# Altium project project6.PrjPcb
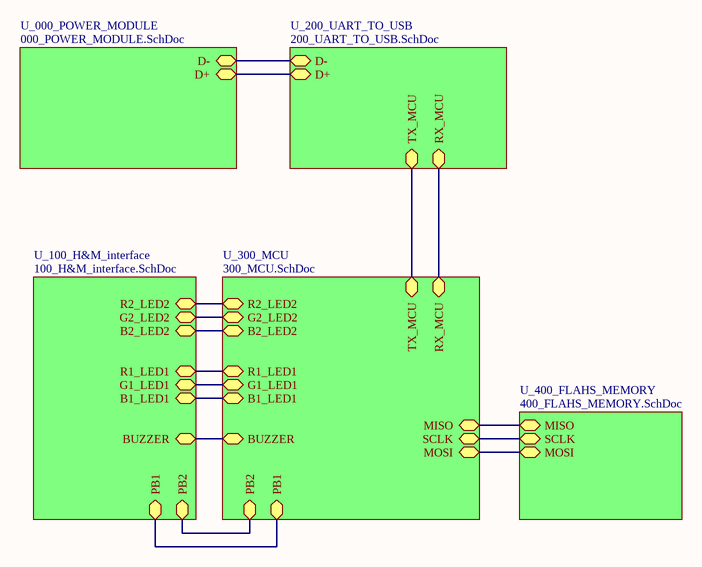
[diagram p0: MAIN.SchDoc]
6 sheets, 86 parts. Net scope: hierarchical (ports join the sheet entries above them; power ports are global).
Board file: project_6.PcbDoc
Sheets:
  MAIN.SchDoc
    U_000_POWER_MODULE = 000_POWER_MODULE.SchDoc
    U_200_UART_TO_USB = 200_UART_TO_USB.SchDoc
    U_100_H&M_interface = 100_H&M_interface.SchDoc
    U_400_FLAHS_MEMORY = 400_FLAHS_MEMORY.SchDoc
    U_300_MCU = 300_MCU.SchDoc

## Sheet MAIN.SchDoc: MAIN
size A4; Organization: Altium Limited; Address1: L3, 12a Rodborough Rd; Address2: Frenchs Forest; Address3: NSW; Address4: Australia 2086; DocumentNumber: 1; SheetNumber: 1; SheetTotal: 6

### Sub-sheets
U_000_POWER_MODULE = 000_POWER_MODULE.SchDoc: D- (bidir), D+ (bidir)
U_100_H&M_interface = 100_H&M_interface.SchDoc: PB1 (bidir), PB2 (bidir), B2_LED2 (bidir), G2_LED2 (bidir), R2_LED2 (bidir), G1_LED1 (bidir), B1_LED1 (bidir), R1_LED1 (bidir), BUZZER (bidir)
U_200_UART_TO_USB = 200_UART_TO_USB.SchDoc: D- (bidir), D+ (bidir), TX_MCU (bidir), RX_MCU (bidir)
U_300_MCU = 300_MCU.SchDoc: SCLK (bidir), MISO (bidir), MOSI (bidir), PB1 (bidir), B2_LED2 (bidir), TX_MCU (bidir), RX_MCU (bidir), R1_LED1 (bidir), G2_LED2 (bidir), R2_LED2 (bidir), G1_LED1 (bidir), B1_LED1 (bidir), PB2 (bidir), BUZZER (bidir)
U_400_FLAHS_MEMORY = 400_FLAHS_MEMORY.SchDoc: MISO (bidir), SCLK (bidir), MOSI (bidir)

### Nets
NetC100_2: sheet U_100_H&M_interface/PB2, sheet U_300_MCU/PB2
NetC101_2: sheet U_100_H&M_interface/PB1, sheet U_300_MCU/PB1
NetR104_1: sheet U_100_H&M_interface/R1_LED1, sheet U_300_MCU/R1_LED1
NetR105_1: sheet U_100_H&M_interface/R2_LED2, sheet U_300_MCU/R2_LED2
NetR108_1: sheet U_100_H&M_interface/BUZZER, sheet U_300_MCU/BUZZER
NetR111_1: sheet U_100_H&M_interface/G1_LED1, sheet U_300_MCU/G1_LED1
NetR112_1: sheet U_100_H&M_interface/G2_LED2, sheet U_300_MCU/G2_LED2
NetR120_1: sheet U_100_H&M_interface/B1_LED1, sheet U_300_MCU/B1_LED1
NetR121_1: sheet U_100_H&M_interface/B2_LED2, sheet U_300_MCU/B2_LED2
NetR300_15: sheet U_400_FLAHS_MEMORY/SCLK, sheet U_300_MCU/SCLK
NetR300_16: sheet U_400_FLAHS_MEMORY/MISO, sheet U_300_MCU/MISO
NetR300_17: sheet U_400_FLAHS_MEMORY/MOSI, sheet U_300_MCU/MOSI
NetR300_30: sheet U_200_UART_TO_USB/TX_MCU, sheet U_300_MCU/TX_MCU
NetR300_31: sheet U_200_UART_TO_USB/RX_MCU, sheet U_300_MCU/RX_MCU
NetU2_4: sheet U_000_POWER_MODULE/D+, sheet U_200_UART_TO_USB/D+
NetU2_6: sheet U_000_POWER_MODULE/D-, sheet U_200_UART_TO_USB/D-

### Notes on the sheet
- Title
- Size:
- Date:
- A4
- Number:
- Time:
- Revision:
- Sheet
- of
- File:

## Sheet 000_POWER_MODULE.SchDoc: Power and inputs
size A4; Organization: Altium Limited; Address1: L3, 12a Rodborough Rd; Address2: Frenchs Forest; Address3: NSW; Address4: Australia 2086; DocumentNumber: 2; SheetNumber: 2; SheetTotal: 6
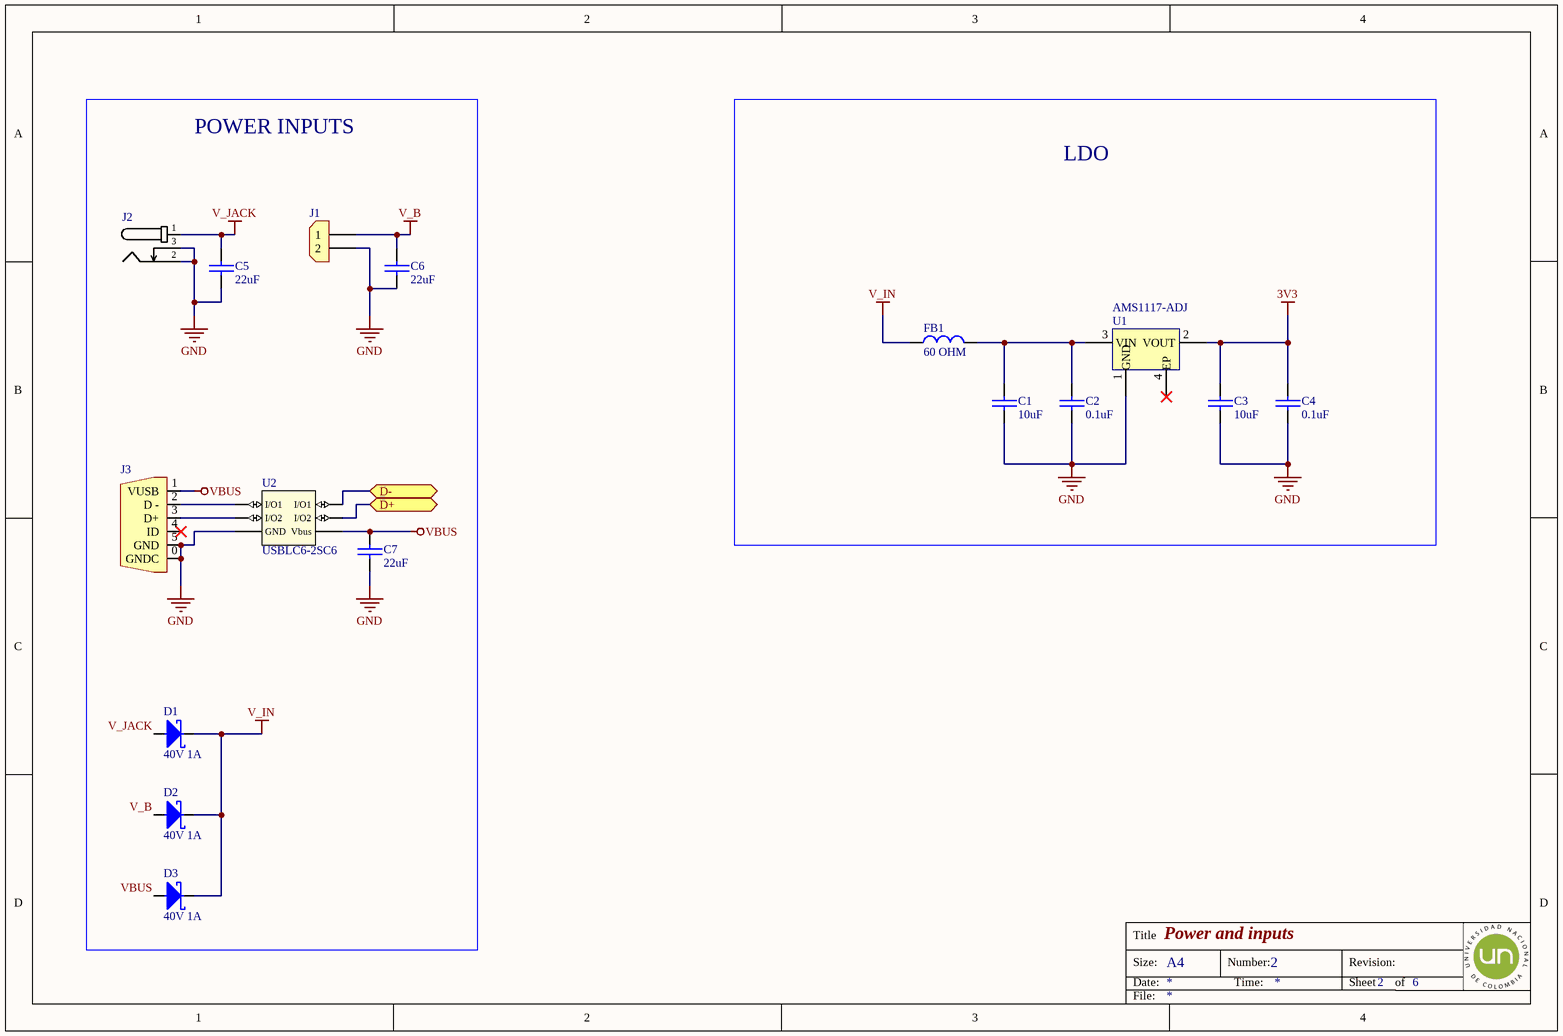
[diagram p1: 000_POWER_MODULE.SchDoc]

### Parts
C1  value 10uF  [0603_cap]  (hidden comment: 10uF 10V)
C2  value 0.1uF  [0603_cap]  (hidden comment: 0.1uF 50V)
C3  value 10uF  [0603_cap]  (hidden comment: 10uF 10V)
C4  value 0.1uF  [0603_cap]  (hidden comment: 0.1uF 50V)
C5  value 22uF  [0603_cap]  (hidden comment: 22uF 6V3)
C6  value 22uF  [0603_cap]  (hidden comment: 22uF 6V3)
C7  value 22uF  [0603_cap]  (hidden comment: 22uF 6V3)
D1  40V 1A  [SOD_123]
D2  40V 1A  [SOD_123]
D3  40V 1A  [SOD_123]
FB1  value 60 OHM  [0603_fb]  (hidden comment: 60OHM 2A)
J1  Connector 2pos  [CON_2x1_TH_5MM]  (value not drawn)
J2  PWR JACK 2.1mm  [CON_POWER_BARREL_2.1MM_3CONN]  (value not drawn)
J3  USB Mini B  [CON_5x1_SMD_miniUSB_B]  (value not drawn)
U1  AMS1117-ADJ  [SOT_223]
U2  USBLC6-2SC6  [SOT_23_6]

### Blocks framed on the sheet
POWER INPUTS: C5-C7 D1-D3 J1-J3 U2
LDO: C1-C4 FB1 U1

### Ports
D+ (bidir, see MAIN[2B], 200_UART_TO_USB[2B]), D- (bidir, see MAIN[2B], 200_UART_TO_USB[2B])

### Nets
3V3: C3.1 C4.1 U1.2(VOUT)
GND: C1.2 C2.2 C3.2 C4.2 C5.2 C6.2 C7.2 J1.2 J2.2 J2.3 J3.0(GNDC) J3.5(GND) U1.1(GND) U2.2(GND)
V_B: C6.1 D2.2 J1.1
V_IN: D1.1 D2.1 D3.1 FB1.1
V_JACK: C5.1 D1.2 J2.1
VBUS: C7.1 D3.2 J3.1(VUSB) U2.5(Vbus)
NetC1_1: C1.1 C2.1 FB1.2 U1.3(VIN)
NetJ3_2: J3.2(D_-) U2.1(I/O1)
NetJ3_3: J3.3(D+) U2.3(I/O2)
NetU2_4: U2.4(I/O2) ; port D+
NetU2_6: U2.6(I/O1) ; port D-

Not connected (* = marked no-connect by the designer): J3 4(ID)*; U1 4(EP)*

### Notes on the sheet
- Title
- Size:
- Date:
- A4
- Number:
- Time:
- Revision:
- Sheet
- of
- File:

### Library data of the parts
C1 C3 = Cap_10uF_0603_10V: 10V 10uF X5R ±10% 0603 Multilayer Ceramic Capacitors MLCC - SMD/SMT ROHS; Manufacturer: CCTC; Manufacturer Part Number: TCC0603X5R106K100CT; Supplier 1: LCSC; Supplier Part Number 1: C380314; ComponentLink1Description: LCSC; ComponentLink1URL: https://www.lcsc.com/product-detail/Multilayer-Ceramic-Capacitors-MLCC-SMD-SMT_CCTC-TCC0603X5R106K100CT_C380314.html
C2 C4 = Cap_0.1uF_0603_50V: 50V 100nF Y5V -20%~+80% 0603 Multilayer Ceramic Capacitors MLCC - SMD/SMT ROHS; Manufacturer: Walsin Tech Corp; Manufacturer Part Number: 0603F104Z500CT; Supplier 1: LCSC; Supplier Part Number 1: C83060; ComponentLink1Description: LCSC; ComponentLink1URL: https://www.lcsc.com/product-detail/Multilayer-Ceramic-Capacitors-MLCC-SMD-SMT_Walsin-Tech-Corp-0603F104Z500CT_C83060.html
C5-C7 = Cap_22uF_0805_6V3: 6.3V 22uF X5R ±20% 0805 Multilayer Ceramic Capacitors MLCC - SMD/SMT ROHS; Manufacturer: Samsung Electro-Mechanics; Manufacturer Part Number: CL21A226MQQNNNE; Supplier 1: LCSC; Supplier Part Number 1: C5674; ComponentLink1Description: LCSC; ComponentLink1URL: https://www.lcsc.com/product-detail/Multilayer-Ceramic-Capacitors-MLCC-SMD-SMT_Samsung-Electro-Mechanics-CL21A226MQQNNNE_C5674.html
D1-D3 = D_Schottky_40V_1A_SOD_123F: DIODE SCHOTTKY 40V 1A SOD123F; Manufacturer: Shanghai Prisemi Elec; Manufacturer Part Number: PSBD1DF40V1H; Supplier 1: LCSC; Supplier Part Number 1: C110730; ComponentLink1Description: LCSC; ComponentLink1URL: https://www.lcsc.com/product-detail/Switching-Diode_Shanghai-Prisemi-Elec-PSBD1DF40V1H_C110730.html
FB1 = FB_60_0603_2A: 2A 1 100mΩ 60Ω@100MHz ±25% 0603 Ferrite Beads ROHS; Manufacturer: TAI-TECH; Manufacturer Part Number: HCB1608KF-600T20; ComponentLink1Description: LCSC; ComponentLink1URL: https://www.lcsc.com/product-detail/Ferrite-Beads_TAI-TECH-HCB1608KF-600T20_C369516.html; Supplier 1: LCSC; Supplier Part Number 1: C369516
J1 = Con_2x1_TH_5mm: 2POS 5MM; Manufacturer: JILN; Manufacturer Part Number: JL126-50002G01; Supplier 1: LCSC; Supplier Part Number 1: C394556; ComponentLink1Description: Digi-Key; ComponentLink1URL: https://www.lcsc.com/product-detail/Screw-terminal_JILN-JL126-50002G01_C394556.html
J2 = Con_Power_Jack_2.1mm_3pins: CONN PWR JACK 2X5.5MM SOLDER; Manufacturer: HCTL; Manufacturer Part Number: HC-DC-005-2.0T; Supplier 1: LCSC; Supplier Part Number 1: C3010533; ComponentLink1Description: LCSC; ComponentLink1URL: https://www.lcsc.com/product-detail/AC-DC-Power-Connectors_HCTL-HC-DC-005-2-0T_C3010533.html
J3 = Con_Mini_USB_B: CONN RCPT USB2.0 MINI B SMD R/A; Manufacturer Part Number: KH-MINI-SMT-5P-Cu; Manufacturer: EDAC Inc.; ComponentLink1Description: LCSC; ComponentLink1URL: https://datasheet.lcsc.com/lcsc/2106070035_Shenzhen-Kinghelm-Elec-KH-MINI-SMT-5P-Cu_C2688795.pdf; Supplier 1: LCSC; Supplier Part Number 1: C2688795
U1 = LDO_3V3_1A: 1A 70dB@(120Hz) 5mA 1.2V@1A Adjustable 1.2V~20V Positive 1 20V Output Adjustable SOT-223-3L Linear Voltage Regulators (LDO) ROHS; Manufacturer: WPMtek(Wei Pan Microelectronics); ComponentLink1Description: LCSC; ComponentLink1URL: https://www.lcsc.com/product-detail/Linear-Voltage-Regulators-LDO_WPMtek-Wei-Pan-Microelectronics-AMS1117-ADJ_C2688238.html; Supplier: LCSC; Manufacturer Part Number: AMS1117-ADJ; Supplier Part Number: C2688238
U2 = TVS_5.25V_2CH_SOT_23_6: TVS DIODE 5.25V 17V SOT23-6; Manufacturer: STMicroelectronics; ComponentLink1Description: LCSC; ComponentLink1URL: https://www.lcsc.com/product-detail/ESD-Protection-Devices_STMicroelectronics-USBLC6-2SC6_C7519.html; Supplier 1: LCSC; Manufacturer Part Number: USBLC6-2SC6; Supplier Part Number 1: C7519

## Sheet 200_UART_TO_USB.SchDoc: USART to USB
size A4; Organization: Altium Limited; Address1: L3, 12a Rodborough Rd; Address2: Frenchs Forest; Address3: NSW; Address4: Australia 2086; DocumentNumber: 4; SheetNumber: 4; SheetTotal: 6
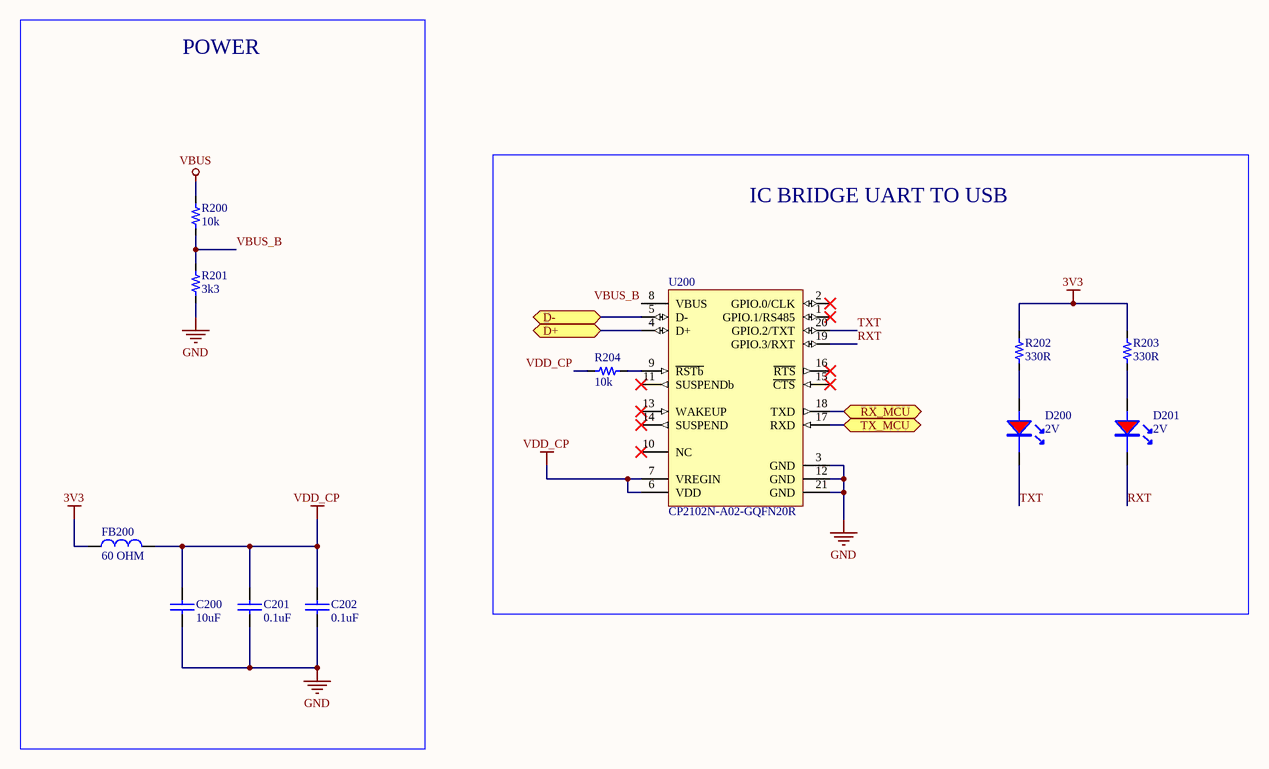
[diagram p2: 200_UART_TO_USB.SchDoc]

### Parts
C200  value 10uF  [0603_cap]  (hidden comment: 10uF 10V)
C201  value 0.1uF  [0603_cap]  (hidden comment: 0.1uF 50V)
C202  value 0.1uF  [0603_cap]  (hidden comment: 0.1uF 50V)
D200  2V  [0805_LED]
D201  2V  [0805_LED]
FB200  value 60 OHM  [0603_fb]  (hidden comment: 60OHM 2A)
R200  value 10k  [0603_res]  (hidden comment: 10k 1/10W)
R201  value 3k3  [0603_res]  (hidden comment: 3k3 1/10W)
R202  value 330R  [0603_res]  (hidden comment: 330R 1/10W)
R203  value 330R  [0603_res]  (hidden comment: 330R 1/10W)
R204  value 10k  [0603_res]  (hidden comment: 10k 1/10W)
U200  CP2102N-A02-GQFN20R  [WFQFN_20_EP_3X3MM]

### Blocks framed on the sheet
POWER: C200-C202 FB200 R200 R201
IC BRIDGE UART TO USB: D200 D201 R202-R204 U200

### Ports
D+ (bidir, see MAIN[3A], 000_POWER_MODULE[1B]), D- (bidir, see MAIN[3A], 000_POWER_MODULE[1B]), RX_MCU (bidir, see MAIN[3B], 300_MCU[3B]), TX_MCU (bidir, see MAIN[3B], 300_MCU[3A])

### Nets
3V3: FB200.1 R202.2 R203.2
GND: C200.2 C201.2 C202.2 R201.1 U200.3(GND) U200.12(GND) U200.21(GND)
VBUS: R200.2
VDD_CP: C200.1 C201.1 C202.1 FB200.2 R204.1 U200.6(VDD) U200.7(VREGIN)
RXT: D201.2 U200.19(GPIO.3/RXT)
TXT: D200.2 U200.20(GPIO.2/TXT)
VBUS_B: R200.1 R201.2 U200.8(VBUS)
NetD200_1: D200.1(A) R202.1
NetD201_1: D201.1(A) R203.1
NetR204_2: R204.2 U200.9(~{RSTb})
NetR300_30: U200.17(RXD) ; port TX_MCU
NetR300_31: U200.18(TXD) ; port RX_MCU
NetU2_4: U200.4(D+) ; port D+
NetU2_6: U200.5(D-) ; port D-

Not connected (* = marked no-connect by the designer): U200 1(GPIO.1/RS485)* 2(GPIO.0/CLK)* 10(NC)* 11(SUSPENDb)* 13(WAKEUP)* 14(SUSPEND)* 15(~{CTS})* 16(~{RTS})*

### Notes on the sheet
- Title
- Size:
- Date:
- A4
- Number:
- Time:
- Revision:
- Sheet
- of
- File:

### Library data of the parts
C200 = Cap_10uF_0603_10V: as C1 on sheet 000_POWER_MODULE; Supplier 1: LCSC; Supplier Part Number 1: C380314; ComponentLink1Description: LCSC; ComponentLink1URL: https://www.lcsc.com/product-detail/Multilayer-Ceramic-Capacitors-MLCC-SMD-SMT_CCTC-TCC0603X5R106K100CT_C380314.html
C201 C202 = Cap_0.1uF_0603_50V: as C2 on sheet 000_POWER_MODULE; Supplier 1: LCSC; Supplier Part Number 1: C83060; ComponentLink1Description: LCSC; ComponentLink1URL: https://www.lcsc.com/product-detail/Multilayer-Ceramic-Capacitors-MLCC-SMD-SMT_Walsin-Tech-Corp-0603F104Z500CT_C83060.html
D200 D201 = LED_0805_RED: LED RED CLEAR 0805 SMD; Manufacturer: XINGLIGHT; Manufacturer Part Number: XL-2012SURC; Supplier 1: LCSC; Supplier Part Number 1: C965812; ComponentLink1Description: LCSC; ComponentLink1URL: https://www.lcsc.com/product-detail/Light-Emitting-Diodes-LED_XINGLIGHT-XL-2012SURC_C965812.html
FB200 = FB_60_0603_2A: as FB1 on sheet 000_POWER_MODULE; ComponentLink1Description: LCSC; ComponentLink1URL: https://www.lcsc.com/product-detail/Ferrite-Beads_TAI-TECH-HCB1608KF-600T20_C369516.html; Supplier 1: LCSC; Supplier Part Number 1: C369516
R200 R204 = Res_10k_0603_1/10W: RES SMD 10k OHM 5% 1/10W 0603; Manufacturer: FOJAN; Manufacturer Part Number: FRC0603J103TS; ComponentLink1URL: https://www.lcsc.com/product-detail/Chip-Resistor-Surface-Mount_FOJAN-FRC0603J103TS_C2930027.html; Supplier 1: LCSC; Supplier Part Number 1: C2930027; ComponentLink1Description: LCSC
R201 = Res_3k3_0603_1/10W: RES SMD 3k3 OHM 5% 1/10W 0603; Manufacturer: FOJAN; Manufacturer Part Number: FRC0603J332 TS; ComponentLink1URL: https://www.lcsc.com/product-detail/Chip-Resistor-Surface-Mount_FOJAN-FRC0603J332-TS_C2907140.html; Supplier 1: LCSC; Supplier Part Number 1: C2907140; ComponentLink1Description: LCSC
R202 R203 = Res_330R_0603_1/10W: RES SMD 330R OHM 5% 1/10W 0603; Manufacturer: FOJAN; Manufacturer Part Number: FRC0603J331 TS; ComponentLink1URL: https://www.lcsc.com/product-detail/Chip-Resistor-Surface-Mount_FOJAN-FRC0603J331-TS_C2907152.html; Supplier 1: LCSC; Supplier Part Number 1: C2907152; ComponentLink1Description: LCSC
U200 = IC_SGL_USB2UART-BRIDGE_20QFN: IC USB TO UART BRIDGE QFN20; Manufacturer: Silicon Labs; Manufacturer Part Number: CP2102N-A02-GQFN20R; Supplier 1: LCSC; Supplier Part Number 1: C969913; ComponentLink1Description: LCSC; ComponentLink1URL: https://www.lcsc.com/product-detail/USB-ICs_SILICON-LABS-CP2102N-A02-GQFN20R_C969913.html

## Sheet 100_H&M_interface.SchDoc: H&M interface
size A4; Organization: Altium Limited; Address1: L3, 12a Rodborough Rd; Address2: Frenchs Forest; Address3: NSW; Address4: Australia 2086; DocumentNumber: 3; SheetNumber: 3; SheetTotal: 6
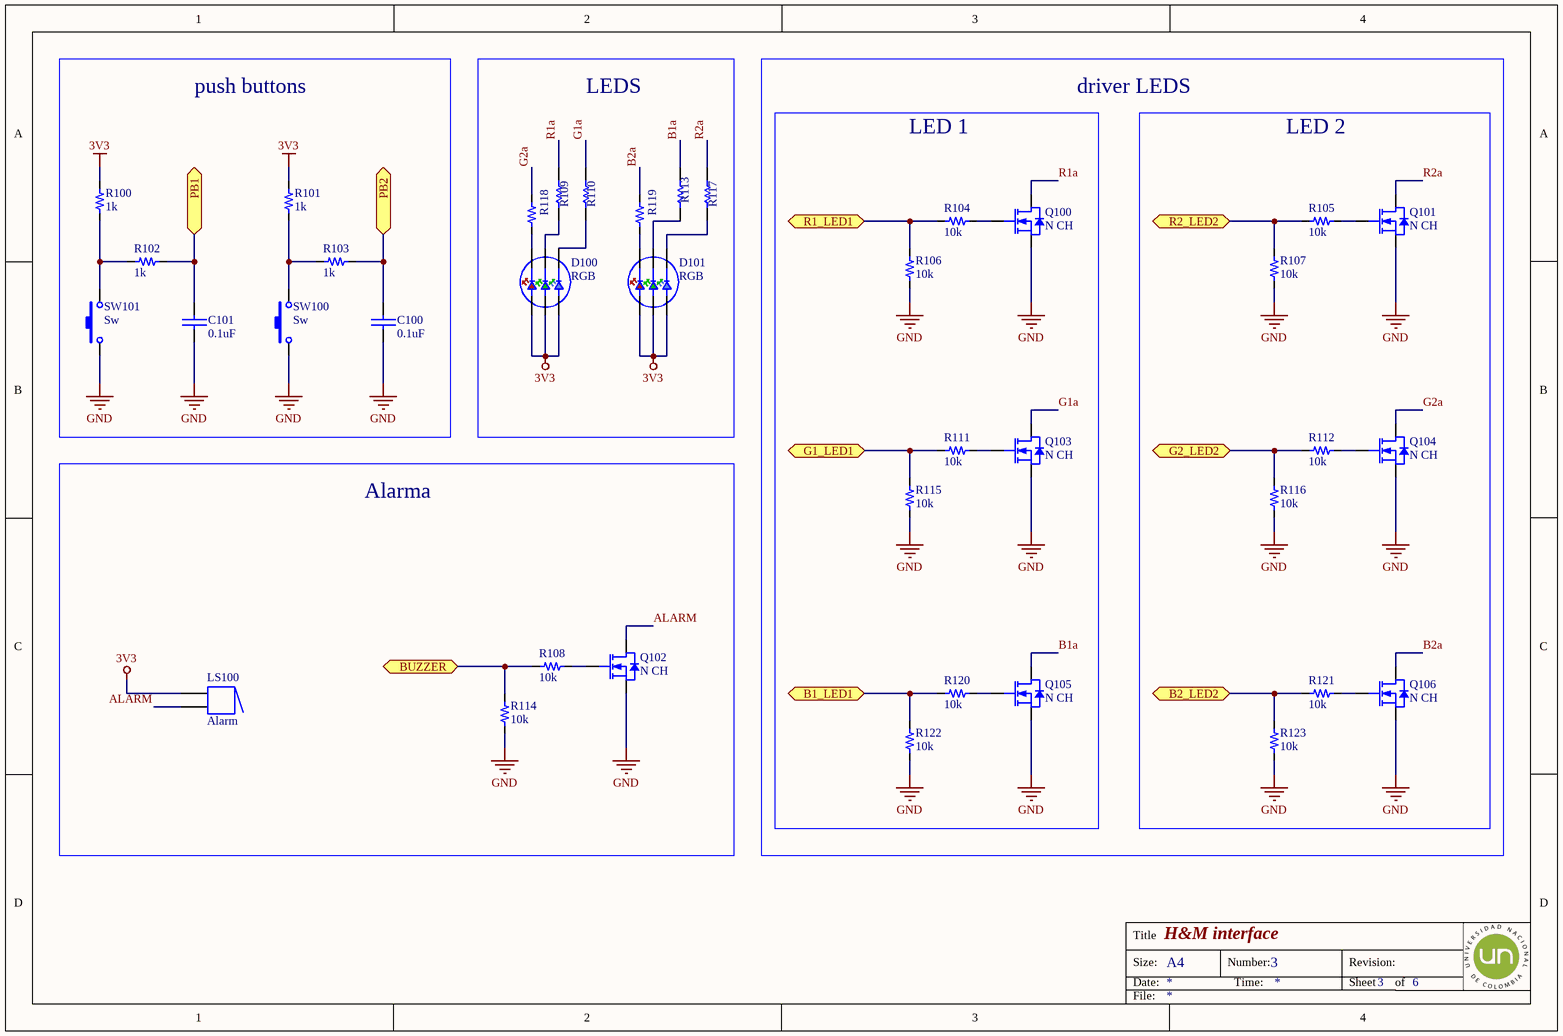
[diagram p3: 100_H&M_interface.SchDoc]

### Parts
C100  value 0.1uF  [0603_cap]  (hidden comment: 0.1uF 50V)
C101  value 0.1uF  [0603_cap]  (hidden comment: 0.1uF 50V)
D100  RGB  [RGB_NS_3.5X3.7]
D101  RGB  [RGB_NS_3.5X3.7]
LS100  Alarm  [Alarm]
Q100  N CH  [SOT_23_3]
Q101  N CH  [SOT_23_3]
Q102  N CH  [SOT_23_3]
Q103  N CH  [SOT_23_3]
Q104  N CH  [SOT_23_3]
Q105  N CH  [SOT_23_3]
Q106  N CH  [SOT_23_3]
R100  value 1k  [0603_res]  (hidden comment: 1k 1/10W)
R101  value 1k  [0603_res]  (hidden comment: 1k 1/10W)
R102  value 1k  [0603_res]  (hidden comment: 1k 1/10W)
R103  value 1k  [0603_res]  (hidden comment: 1k 1/10W)
R104  value 10k  [0603_res]  (hidden comment: 10k 1/10W)
R105  value 10k  [0603_res]  (hidden comment: 10k 1/10W)
R106  value 10k  [0603_res]  (hidden comment: 10k 1/10W)
R107  value 10k  [0603_res]  (hidden comment: 10k 1/10W)
R108  value 10k  [0603_res]  (hidden comment: 10k 1/10W)
R109  330R 1/10W  [0603_res]  (value not drawn)
R110  330R 1/10W  [0603_res]  (value not drawn)
R111  value 10k  [0603_res]  (hidden comment: 10k 1/10W)
R112  value 10k  [0603_res]  (hidden comment: 10k 1/10W)
R113  330R 1/10W  [0603_res]  (value not drawn)
R114  value 10k  [0603_res]  (hidden comment: 10k 1/10W)
R115  value 10k  [0603_res]  (hidden comment: 10k 1/10W)
R116  value 10k  [0603_res]  (hidden comment: 10k 1/10W)
R117  330R 1/10W  [0603_res]  (value not drawn)
R118  330R 1/10W  [0603_res]  (value not drawn)
R119  330R 1/10W  [0603_res]  (value not drawn)
R120  value 10k  [0603_res]  (hidden comment: 10k 1/10W)
R121  value 10k  [0603_res]  (hidden comment: 10k 1/10W)
R122  value 10k  [0603_res]  (hidden comment: 10k 1/10W)
R123  value 10k  [0603_res]  (hidden comment: 10k 1/10W)
SW100  Sw  [Sw_PUSH_4.5x4.5x5mm]
SW101  Sw  [Sw_PUSH_4.5x4.5x5mm]

### Blocks framed on the sheet
push buttons: C100 C101 R100-R103 SW100 SW101
LEDS: D100 D101 R109 R110 R113 R117-R119
LED 2: Q101 Q104 Q106 R105 R107 R112 R116 R121 R123
Alarma: LS100 Q102 R108 R114

### Ports
B1_LED1 (bidir, see MAIN[2C], 300_MCU[3B]), B2_LED2 (bidir, see MAIN[2C], 300_MCU[3B]), BUZZER (bidir, see MAIN[2C], 300_MCU[3A]), G1_LED1 (bidir, see MAIN[2C], 300_MCU[3B]), G2_LED2 (bidir, see MAIN[2C], 300_MCU[3B]), PB1 (bidir, see MAIN[2C], 300_MCU[3B]), PB2 (bidir, see MAIN[2C], 300_MCU[3B]), R1_LED1 (bidir, see MAIN[2C], 300_MCU[3B]), R2_LED2 (bidir, see MAIN[2C], 300_MCU[3B])

### Nets
3V3: D100.4 D100.5 D100.6 D101.4 D101.5 D101.6 LS100.0 R100.2 R101.2
GND: C100.1 C101.1 Q100.2(S) Q101.2(S) Q102.2(S) Q103.2(S) Q104.2(S) Q105.2(S) Q106.2(S) R106.1 R107.1 R114.1 R115.1 R116.1 R122.1 R123.1 SW100.1 SW101.1
ALARM: LS100.1(2A) Q102.3(D)
B1a: Q105.3(D) R113.2
B2a: Q106.3(D) R119.2
G1a: Q103.3(D) R110.2
G2a: Q104.3(D) R118.2
R1a: Q100.3(D) R109.2
R2a: Q101.3(D) R117.2
NetC100_2: C100.2 R103.1 ; port PB2
NetC101_2: C101.2 R102.1 ; port PB1
NetD100_1: D100.1 R110.1
NetD100_2: D100.2 R109.1
NetD100_3: D100.3 R118.1
NetD101_1: D101.1 R117.1
NetD101_2: D101.2 R113.1
NetD101_3: D101.3 R119.1
NetQ100_1: Q100.1(G) R104.2
NetQ101_1: Q101.1(G) R105.2
NetQ102_1: Q102.1(G) R108.2
NetQ103_1: Q103.1(G) R111.2
NetQ104_1: Q104.1(G) R112.2
NetQ105_1: Q105.1(G) R120.2
NetQ106_1: Q106.1(G) R121.2
NetR100_1: R100.1 R102.2 SW101.2
NetR101_1: R101.1 R103.2 SW100.2
NetR104_1: R104.1 R106.2 ; port R1_LED1
NetR105_1: R105.1 R107.2 ; port R2_LED2
NetR108_1: R108.1 R114.2 ; port BUZZER
NetR111_1: R111.1 R115.2 ; port G1_LED1
NetR112_1: R112.1 R116.2 ; port G2_LED2
NetR120_1: R120.1 R122.2 ; port B1_LED1
NetR121_1: R121.1 R123.2 ; port B2_LED2

### Notes on the sheet
- driver LEDS
- LED 1
- Title
- Size:
- Date:
- A4
- Number:
- Time:
- Revision:
- Sheet
- of
- File:

### Library data of the parts
C100 C101 = Cap_0.1uF_0603_50V: as C2 on sheet 000_POWER_MODULE; Supplier 1: LCSC; Supplier Part Number 1: C83060; ComponentLink1Description: LCSC; ComponentLink1URL: https://www.lcsc.com/product-detail/Multilayer-Ceramic-Capacitors-MLCC-SMD-SMT_Walsin-Tech-Corp-0603F104Z500CT_C83060.html
D100 D101 = LED_RGB_3535_SMD: -30℃~+85℃ RGB 110° 3535(mm) Light Emitting Diodes (LED) ROHS; Manufacturer: Foshan NationStar Optoelectronics; Manufacturer Part Number: RS-3535MWAM; Supplier 1: LCSC; Supplier Part Number 1: C842778; ComponentLink1Description: LCSC; ComponentLink1URL: https://www.lcsc.com/product-detail/Light-Emitting-Diodes-LED_Foshan-NationStar-Optoelectronics-RS-3535MWAM_C842778.html
LS100 = Alarm: Buzzers Indicator, Internally Driven Piezo 12 V 300mA 2.5kHz 100dB @ 12V, 100cm Panel Mount, Flange Wire Leads; Manufacture: Mallory Sonalert Products Inc.; Manufacture Part Number: PS-583Q; Usage: Trough hole; Supplier: Digi-key; Supplier Part Number: PS-583Q-ND; ComponentLink1Description: Datasheet; ComponentLink1URL: https://www.digikey.com/en/products/detail/mallory-sonalert-products-inc/PS-583Q/1957914?s=N4IgTCBcDaIAoGUC0BWAHAZgIogLoF8g
Q100-Q106 = Q_NFET_20V_3.2A_SOT23: MOSFET N-CH 20V SOT23; Manufacturer: Doeshare; Manufacturer Part Number: DN2302S; Supplier 1: LCSC; Supplier Part Number 1: C2931750; ComponentLink1Description: LCSC; ComponentLink1URL: https://www.lcsc.com/product-detail/MOSFETs_Doeshare-DN2302S_C2931750.html
R100-R103 = Res_1k_0603_1/10W: RES SMD 1k OHM 5% 1/10W 0603; Manufacturer: FOJAN; Manufacturer Part Number: FRC0603J102 TS; ComponentLink1URL: https://www.lcsc.com/product-detail/Chip-Resistor-Surface-Mount_FOJAN-FRC0603J102-TS_C2907113.html; Supplier 1: LCSC; Supplier Part Number 1: C2907113; ComponentLink1Description: LCSC
R104-R108 R111 R112 R114-R116 R120-R123 = Res_10k_0603_1/10W: as R200 on sheet 200_UART_TO_USB; ComponentLink1URL: https://www.lcsc.com/product-detail/Chip-Resistor-Surface-Mount_FOJAN-FRC0603J103TS_C2930027.html; Supplier 1: LCSC; Supplier Part Number 1: C2930027; ComponentLink1Description: LCSC
R109 R110 R113 R117 = RES_130R_0603: 100mW Thin Film Resistor ±0.1% 130Ω 0603 Chip Resistor - Surface Mount ROHS; Manufacture: resistor today; Manufacture Part Number: PTFR0603B130RP9; Suplier Part Number: C351683; Usage: 0603; Supplier: lcsc; ComponentLink1Description: LCSC; ComponentLink1URL: https://www.lcsc.com/product-detail/Chip-span-style-background-color-ff0-Resistor-span-Surface-Mount_span-style-background-color-ff0-Resistor-span-Today-PTFR0603B130RP9_C351683.html
R118 R119 = Res_100R_0603_1/10W: RES SMD 100R OHM 5% 1/10W 0603; Manufacturer: FOJAN; Manufacturer Part Number: FRC0603J101 TS; ComponentLink1URL: https://www.lcsc.com/product-detail/Chip-Resistor-Surface-Mount_FOJAN-FRC0603J101-TS_C2907089.html; Supplier 1: LCSC; Supplier Part Number 1: C2907089; ComponentLink1Description: LCSC; Value: 100R
SW100 SW101 = Sw_PUSH_4.5x4.5x5.0xmm: SWITCH TACTILE SPST-NO 0.05A 12V; Manufacturer: BZCN; Manufacturer Part Number: TSC015A05026A; Supplier 1: LCSC; Supplier Part Number 1: C2888509; Last modified by: N-A.Potosi; Last modified date: 20190222; ComponentLink1Description: LCSC; ComponentLink1URL: https://www.lcsc.com/product-detail/Tactile-Switches_BZCN-TSC015A05026A_C2888509.html

## Sheet 400_FLAHS_MEMORY.SchDoc: FLASH MEMORY
size A4; DocumentNumber: 6; SheetNumber: 6; SheetTotal: 6
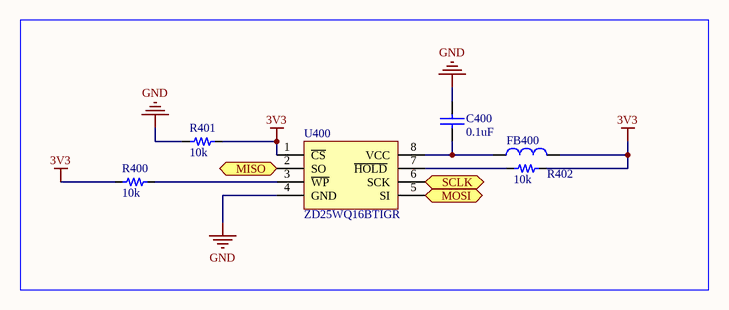
[diagram p4: 400_FLAHS_MEMORY.SchDoc]

### Parts
C400  value 0.1uF  [0603_cap]  (hidden comment: 0.1uF 50V)
FB400  60OHM 2A  [0603_fb]  (value not drawn)
R400  value 10k  [0603_res]  (hidden comment: 10k 1/10W)
R401  value 10k  [0603_res]  (hidden comment: 10k 1/10W)
R402  value 10k  [0603_res]  (hidden comment: 10k 1/10W)
U400  ZD25WQ16BTIGR  [SOIC_8_3.9mm]

### Ports
MISO (bidir, see MAIN[3C], 300_MCU[3A]), MOSI (bidir, see MAIN[3C], 300_MCU[3A]), SCLK (bidir, see MAIN[3C], 300_MCU[3A])

### Nets
3V3: FB400.2 R400.1 R401.2 R402.2 U400.1(~{CS})
GND: C400.2 R401.1 U400.4(GND)
NetC400_1: C400.1 FB400.1 U400.8(VCC)
NetR300_15: U400.6(SCK) ; port SCLK
NetR300_16: U400.2(SO) ; port MISO
NetR300_17: U400.5(SI) ; port MOSI
NetR400_2: R400.2 U400.3(~{WP})
NetR402_1: R402.1 U400.7(~{HOLD})

### Notes on the sheet
- Title
- Size:
- Date:
- A4
- Number:
- Time:
- Revision:
- Sheet
- of
- File:

### Library data of the parts
C400 = Cap_0.1uF_0603_50V: as C2 on sheet 000_POWER_MODULE; Supplier 1: LCSC; Supplier Part Number 1: C83060; ComponentLink1Description: LCSC; ComponentLink1URL: https://www.lcsc.com/product-detail/Multilayer-Ceramic-Capacitors-MLCC-SMD-SMT_Walsin-Tech-Corp-0603F104Z500CT_C83060.html
FB400 = FB_60_0603_2A: as FB1 on sheet 000_POWER_MODULE; ComponentLink1Description: LCSC; ComponentLink1URL: https://www.lcsc.com/product-detail/Ferrite-Beads_TAI-TECH-HCB1608KF-600T20_C369516.html; Supplier 1: LCSC; Supplier Part Number 1: C369516
R400-R402 = Res_10k_0603_1/10W: as R200 on sheet 200_UART_TO_USB; ComponentLink1URL: https://www.lcsc.com/product-detail/Chip-Resistor-Surface-Mount_FOJAN-FRC0603J103TS_C2930027.html; Supplier 1: LCSC; Supplier Part Number 1: C2930027; ComponentLink1Description: LCSC
U400 = IC_FLASH_ZD25WQ16BTIGR_8SOP: IC FLASH 16M SPI 85MHZ 8SOP; Manufacturer: Zetta; Manufacturer Part Number: ZD25WQ16BTIGR; Supplier 1: LCSC; Supplier Part Number 1: C2896790; ComponentLink1Description: LCSC; ComponentLink1URL: https://www.lcsc.com/product-detail/NOR-FLASH_Zetta-ZD25WQ16BTIGR_C2896790.html

## Sheet 300_MCU.SchDoc: MCU
size A4; Organization: Altium Limited; Address1: L3, 12a Rodborough Rd; Address2: Frenchs Forest; Address3: NSW; Address4: Australia 2086; DocumentNumber: 5; SheetNumber: 5; SheetTotal: 6
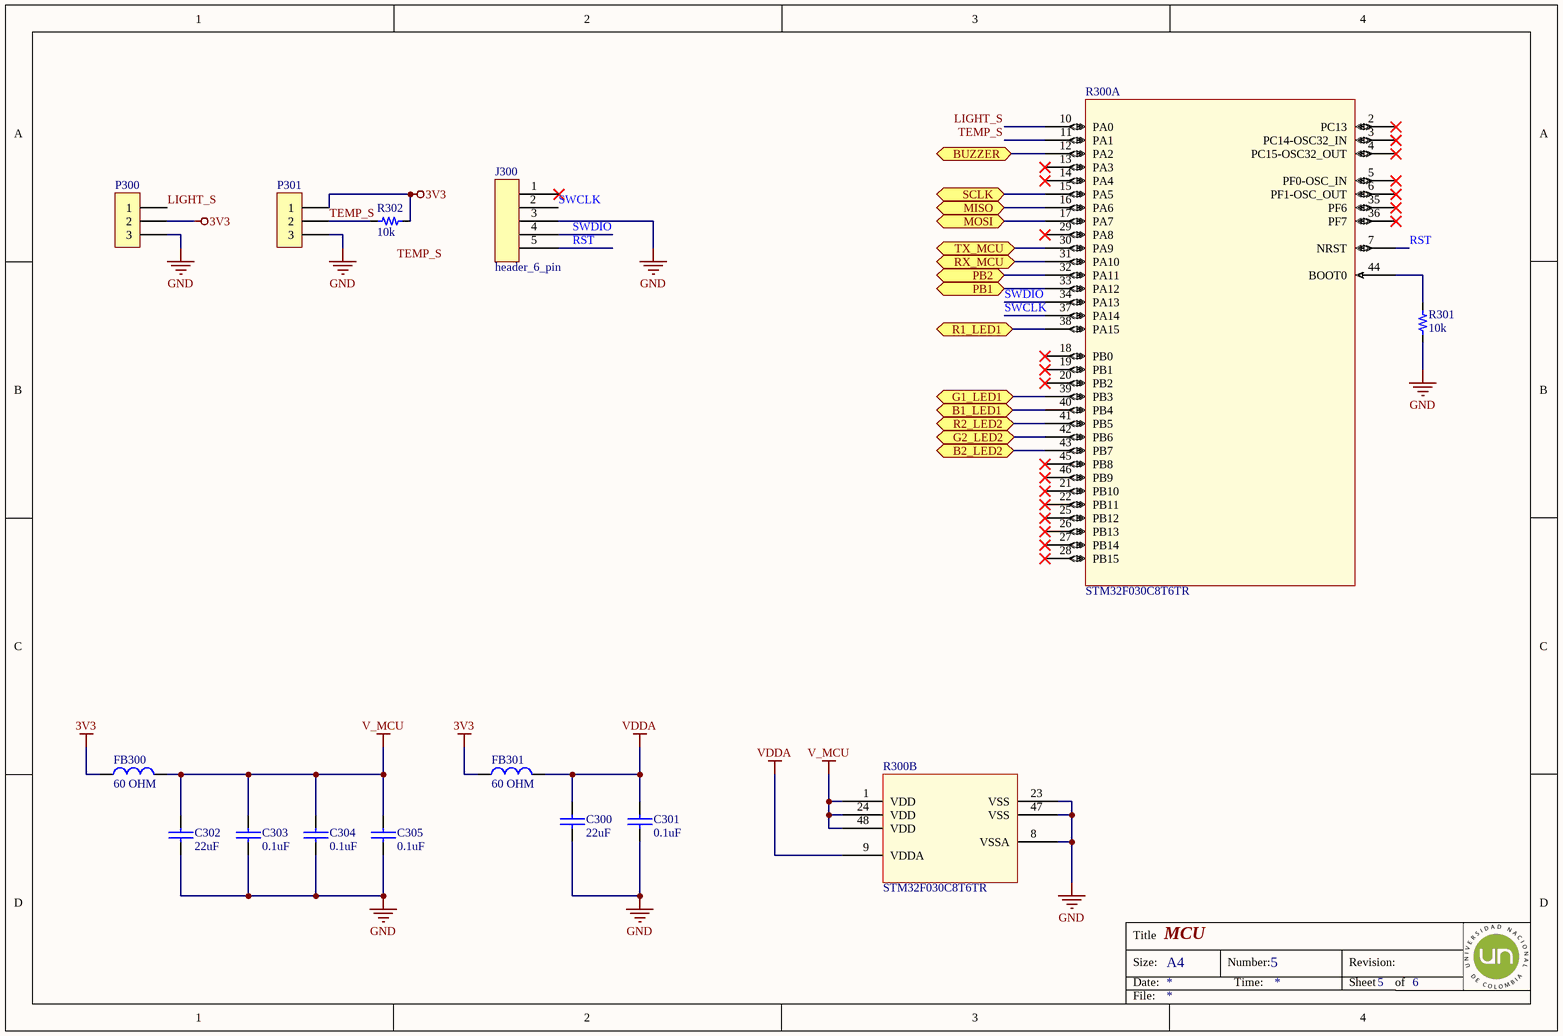
[diagram p5: 300_MCU.SchDoc]

### Parts
C300  value 22uF  [0603_cap]  (hidden comment: 22uF 6V3)
C301  value 0.1uF  [0603_cap]  (hidden comment: 0.1uF 50V)
C302  value 22uF  [0603_cap]  (hidden comment: 22uF 6V3)
C303  value 0.1uF  [0603_cap]  (hidden comment: 0.1uF 50V)
C304  value 0.1uF  [0603_cap]  (hidden comment: 0.1uF 50V)
C305  value 0.1uF  [0603_cap]  (hidden comment: 0.1uF 50V)
FB300  value 60 OHM  [0603_fb]  (hidden comment: 60OHM 2A)
FB301  value 60 OHM  [0603_fb]  (hidden comment: 60OHM 2A)
J300  header_6_pin  [header_6_pin]
P300  HEAD_FEMALE_3  [HEAD_FEMALE_3]  (value not drawn)
P301  HEAD_FEMALE_3  [HEAD_FEMALE_3]  (value not drawn)
R300  STM32F030C8T6TR  [LQFP48_7x7mm]  (parts A,B of 2)
R301  value 10k  [0603_res]  (hidden comment: 10k 1/10W)
R302  value 10k  [0603_res]  (hidden comment: 10k 1/10W)

### Ports
B1_LED1 (bidir, see MAIN[2C], 100_H&M_interface[3C]), B2_LED2 (bidir, see MAIN[2C], 100_H&M_interface[3C]), BUZZER (bidir, see MAIN[2C], 100_H&M_interface[1C]), G1_LED1 (bidir, see MAIN[2C], 100_H&M_interface[3B]), G2_LED2 (bidir, see MAIN[2C], 100_H&M_interface[3B]), MISO (bidir, see MAIN[3C], 400_FLAHS_MEMORY[2B]), MOSI (bidir, see MAIN[3C], 400_FLAHS_MEMORY[3C]), PB1 (bidir, see MAIN[3C], 100_H&M_interface[1A]), PB2 (bidir, see MAIN[3C], 100_H&M_interface[1A]), R1_LED1 (bidir, see MAIN[2C], 100_H&M_interface[3A]), R2_LED2 (bidir, see MAIN[2C], 100_H&M_interface[3A]), RX_MCU (bidir, see MAIN[3B], 200_UART_TO_USB[3C]), SCLK (bidir, see MAIN[3C], 400_FLAHS_MEMORY[3B]), TX_MCU (bidir, see MAIN[3B], 200_UART_TO_USB[3C])

### Nets
3V3: FB300.1 FB301.1 P300.2 P301.1 R302.2
GND: C300.2 C301.2 C302.2 C303.2 C304.2 C305.2 J300.3 P300.3 P301.3 R300.8(VSSA) R300.23(VSS) R300.47(VSS) R301.1
V_MCU: C302.1 C303.1 C304.1 C305.1 FB300.2 R300.1(VDD) R300.24(VDD) R300.48(VDD)
VDDA: C300.1 C301.1 FB301.2 R300.9(VDDA)
LIGHT_S: P300.1 R300.10(PA0)
RST: J300.5 R300.7(NRST)
SWCLK: J300.2 R300.37(PA14)
SWDIO: J300.4 R300.34(PA13)
TEMP_S: P301.2 R300.11(PA1) R302.1
NetC100_2: R300.32(PA11) ; port PB2
NetC101_2: R300.33(PA12) ; port PB1
NetR104_1: R300.38(PA15) ; port R1_LED1
NetR105_1: R300.41(PB5) ; port R2_LED2
NetR108_1: R300.12(PA2) ; port BUZZER
NetR111_1: R300.39(PB3) ; port G1_LED1
NetR112_1: R300.42(PB6) ; port G2_LED2
NetR120_1: R300.40(PB4) ; port B1_LED1
NetR121_1: R300.43(PB7) ; port B2_LED2
NetR300_15: R300.15(PA5) ; port SCLK
NetR300_16: R300.16(PA6) ; port MISO
NetR300_17: R300.17(PA7) ; port MOSI
NetR300_30: R300.30(PA9) ; port TX_MCU
NetR300_31: R300.31(PA10) ; port RX_MCU
NetR300_44: R300.44(BOOT0) R301.2

Not connected (* = marked no-connect by the designer): J300 1(5)*; R300 2(PC13)* 3(PC14-OSC32_IN)* 4(PC15-OSC32_OUT)* 5(PF0-OSC_IN)* 6(PF1-OSC_OUT)* 13(PA3)* 14(PA4)* 18(PB0)* 19(PB1)* 20(PB2)* 21(PB10)* 22(PB11)* 25(PB12)* 26(PB13)* 27(PB14)* 28(PB15)* 29(PA8)* 35(PF6)* 36(PF7)* 45(PB8)* 46(PB9)*

### Notes on the sheet
- Labels drawn without touching a wire or pin: TEMP_S
- Title
- Size:
- Date:
- A4
- Number:
- Time:
- Revision:
- Sheet
- of
- File:

### Library data of the parts
C300 C302 = Cap_22uF_0805_6V3: as C5 on sheet 000_POWER_MODULE; Supplier 1: LCSC; Supplier Part Number 1: C5674; ComponentLink1Description: LCSC; ComponentLink1URL: https://www.lcsc.com/product-detail/Multilayer-Ceramic-Capacitors-MLCC-SMD-SMT_Samsung-Electro-Mechanics-CL21A226MQQNNNE_C5674.html
C301 C303-C305 = Cap_0.1uF_0603_50V: as C2 on sheet 000_POWER_MODULE; Supplier 1: LCSC; Supplier Part Number 1: C83060; ComponentLink1Description: LCSC; ComponentLink1URL: https://www.lcsc.com/product-detail/Multilayer-Ceramic-Capacitors-MLCC-SMD-SMT_Walsin-Tech-Corp-0603F104Z500CT_C83060.html
FB300 FB301 = FB_60_0603_2A: as FB1 on sheet 000_POWER_MODULE; ComponentLink1Description: LCSC; ComponentLink1URL: https://www.lcsc.com/product-detail/Ferrite-Beads_TAI-TECH-HCB1608KF-600T20_C369516.html; Supplier 1: LCSC; Supplier Part Number 1: C369516
J300 = header_6_pin: Straight Square Pins 2mm 3.9mm -40℃~+105℃ 2.8mm 5 2mm 单排 Black Brass 1x5P Plugin,P=2mm Pin Headers ROHS; Manufacturer: XFCN; Manufacturer part Number: PZ200V-11-05P; ComponentLink1Description: LCSC; ComponentLink1URL: https://www.lcsc.com/product-detail/span-style-background-color-ff0-Pin-span-span-style-background-color-ff0-Headers-span_XFCN-PZ200V-11-05P_C541859.html; Supplier: LCSC; Supplier Part Number: C541859; Usage: Straight
P300 P301 = HEAD_FEMALE_3: 2.54mm 单排 Gold Straight 1x3P 3 Plugin,P=2.54mm Female Headers ROHS; Manufacture: MINTRON; Manufacture Part Number: MTF185-103SY1; Supplier: LCSC; Usage: Straight; Supplier Part Number: C358717; ComponentLink1Description: datasheet; ComponentLink1URL: https://datasheet.lcsc.com/lcsc/1912111437_MINTRON-MTF185-103SY1_C358717.pdf
R300 = IC_STM32F030C8T6TR_LQFP48_7x7MM: IC MCU 32BIT 64KB FLASH 48LQFP; Manufacturer: STMicroelectronics; Manufacturer part number: STM32F030C8T6TR; Supplier 1: LCSC; Supplier Part Number 1: C23922; ComponentLink1Description: LCSC; ComponentLink1URL: https://www.lcsc.com/product-detail/ST-Microelectronics_STMicroelectronics-STM32F030C8T6_C23922.html
R301 R302 = Res_10k_0603_1/10W: as R200 on sheet 200_UART_TO_USB; ComponentLink1URL: https://www.lcsc.com/product-detail/Chip-Resistor-Surface-Mount_FOJAN-FRC0603J103TS_C2930027.html; Supplier 1: LCSC; Supplier Part Number 1: C2930027; ComponentLink1Description: LCSC

## Nets that join several sheets
3V3: 000_POWER_MODULE (C3.1 C4.1 U1.2), 200_UART_TO_USB (FB200.1 R202.2 R203.2), 100_H&M_interface (9 pins), 400_FLAHS_MEMORY (5 pins), 300_MCU (5 pins)
GND: 000_POWER_MODULE (14 pins), 200_UART_TO_USB (7 pins), 100_H&M_interface (18 pins), 400_FLAHS_MEMORY (C400.2 R401.1 U400.4), 300_MCU (13 pins)
VBUS: 000_POWER_MODULE (C7.1 D3.2 J3.1 U2.5), 200_UART_TO_USB (R200.2)
NetC100_2: 100_H&M_interface (C100.2 R103.1), 300_MCU (R300.32)
NetC101_2: 100_H&M_interface (C101.2 R102.1), 300_MCU (R300.33)
NetR104_1: 100_H&M_interface (R104.1 R106.2), 300_MCU (R300.38)
NetR105_1: 100_H&M_interface (R105.1 R107.2), 300_MCU (R300.41)
NetR108_1: 100_H&M_interface (R108.1 R114.2), 300_MCU (R300.12)
NetR111_1: 100_H&M_interface (R111.1 R115.2), 300_MCU (R300.39)
NetR112_1: 100_H&M_interface (R112.1 R116.2), 300_MCU (R300.42)
NetR120_1: 100_H&M_interface (R120.1 R122.2), 300_MCU (R300.40)
NetR121_1: 100_H&M_interface (R121.1 R123.2), 300_MCU (R300.43)
NetR300_15: 400_FLAHS_MEMORY (U400.6), 300_MCU (R300.15)
NetR300_16: 400_FLAHS_MEMORY (U400.2), 300_MCU (R300.16)
NetR300_17: 400_FLAHS_MEMORY (U400.5), 300_MCU (R300.17)
NetR300_30: 200_UART_TO_USB (U200.17), 300_MCU (R300.30)
NetR300_31: 200_UART_TO_USB (U200.18), 300_MCU (R300.31)
NetU2_4: 000_POWER_MODULE (U2.4), 200_UART_TO_USB (U200.4)
NetU2_6: 000_POWER_MODULE (U2.6), 200_UART_TO_USB (U200.5)